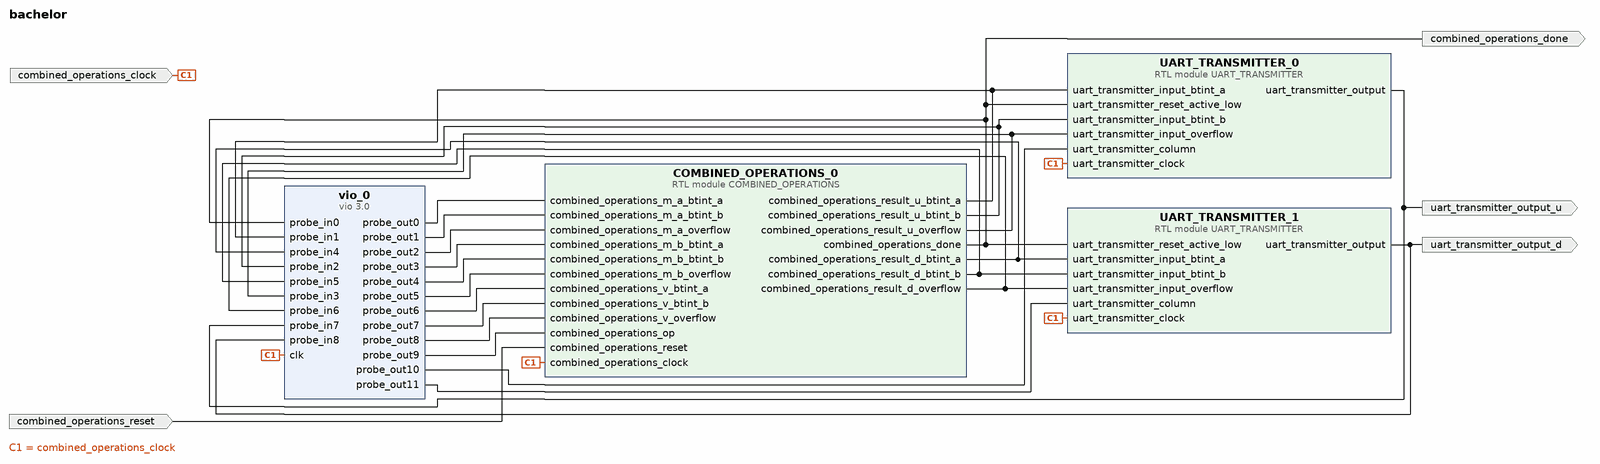
[diagram p0: block diagram of the top level]
# Vivado block design bachelor, xc7z020clg484-1, Vivado 2023.2
create_bd_design bachelor

create_bd_port -dir I -type clk combined_operations_clock
set_property -dict {CONFIG.ASSOCIATED_RESET combined_operations_reset} [get_bd_ports combined_operations_clock]
create_bd_port -dir I -type rst combined_operations_reset
create_bd_port -dir O combined_operations_done
create_bd_port -dir O uart_transmitter_output_u
create_bd_port -dir O uart_transmitter_output_d

create_bd_cell -type module -reference COMBINED_OPERATIONS COMBINED_OPERATIONS_0
create_bd_cell -type module -reference UART_TRANSMITTER UART_TRANSMITTER_0
create_bd_cell -type module -reference UART_TRANSMITTER UART_TRANSMITTER_1
create_bd_cell -type ip -vlnv xilinx.com:ip:vio:3.0 vio_0
set_property -dict [list \
  CONFIG.C_NUM_PROBE_IN 9 \
  CONFIG.C_NUM_PROBE_OUT 12 \
  CONFIG.C_PROBE_OUT0_WIDTH 96 \
  CONFIG.C_PROBE_OUT10_WIDTH 32 \
  CONFIG.C_PROBE_OUT11_WIDTH 32 \
  CONFIG.C_PROBE_OUT1_WIDTH 96 \
  CONFIG.C_PROBE_OUT2_WIDTH 24 \
  CONFIG.C_PROBE_OUT3_WIDTH 96 \
  CONFIG.C_PROBE_OUT4_WIDTH 96 \
  CONFIG.C_PROBE_OUT5_WIDTH 24 \
  CONFIG.C_PROBE_OUT6_WIDTH 24 \
  CONFIG.C_PROBE_OUT7_WIDTH 24 \
  CONFIG.C_PROBE_OUT8_WIDTH 6 \
  CONFIG.C_PROBE_OUT9_WIDTH 2 \
] [get_bd_cells vio_0]

# ---- connections ----

connect_bd_net [get_bd_pins COMBINED_OPERATIONS_0/combined_operations_done] \
  [get_bd_ports combined_operations_done] [get_bd_pins vio_0/probe_in0] \
  [get_bd_pins UART_TRANSMITTER_0/uart_transmitter_reset_active_low] \
  [get_bd_pins UART_TRANSMITTER_1/uart_transmitter_reset_active_low]
connect_bd_net [get_bd_pins COMBINED_OPERATIONS_0/combined_operations_result_d_btint_a] \
  [get_bd_pins vio_0/probe_in4] [get_bd_pins UART_TRANSMITTER_1/uart_transmitter_input_btint_a]
connect_bd_net [get_bd_pins COMBINED_OPERATIONS_0/combined_operations_result_d_btint_b] \
  [get_bd_pins vio_0/probe_in5] [get_bd_pins UART_TRANSMITTER_1/uart_transmitter_input_btint_b]
connect_bd_net [get_bd_pins COMBINED_OPERATIONS_0/combined_operations_result_d_overflow] \
  [get_bd_pins vio_0/probe_in6] [get_bd_pins UART_TRANSMITTER_1/uart_transmitter_input_overflow]
connect_bd_net [get_bd_pins COMBINED_OPERATIONS_0/combined_operations_result_u_btint_a] \
  [get_bd_pins vio_0/probe_in1] [get_bd_pins UART_TRANSMITTER_0/uart_transmitter_input_btint_a]
connect_bd_net [get_bd_pins COMBINED_OPERATIONS_0/combined_operations_result_u_btint_b] \
  [get_bd_pins vio_0/probe_in2] [get_bd_pins UART_TRANSMITTER_0/uart_transmitter_input_btint_b]
connect_bd_net [get_bd_pins COMBINED_OPERATIONS_0/combined_operations_result_u_overflow] \
  [get_bd_pins vio_0/probe_in3] [get_bd_pins UART_TRANSMITTER_0/uart_transmitter_input_overflow]
connect_bd_net [get_bd_pins UART_TRANSMITTER_0/uart_transmitter_output] [get_bd_ports uart_transmitter_output_u] [get_bd_pins vio_0/probe_in7]
connect_bd_net [get_bd_pins UART_TRANSMITTER_1/uart_transmitter_output] [get_bd_ports uart_transmitter_output_d] [get_bd_pins vio_0/probe_in8]
connect_bd_net -net combined_operations_clock_0_1 [get_bd_ports combined_operations_clock] \
  [get_bd_pins vio_0/clk] [get_bd_pins COMBINED_OPERATIONS_0/combined_operations_clock] \
  [get_bd_pins UART_TRANSMITTER_0/uart_transmitter_clock] [get_bd_pins UART_TRANSMITTER_1/uart_transmitter_clock]
connect_bd_net -net combined_operations_reset_0_1 [get_bd_ports combined_operations_reset] \
  [get_bd_pins COMBINED_OPERATIONS_0/combined_operations_reset]
connect_bd_net [get_bd_pins vio_0/probe_out0] [get_bd_pins COMBINED_OPERATIONS_0/combined_operations_m_a_btint_a]
connect_bd_net [get_bd_pins vio_0/probe_out1] [get_bd_pins COMBINED_OPERATIONS_0/combined_operations_m_a_btint_b]
connect_bd_net [get_bd_pins vio_0/probe_out2] [get_bd_pins COMBINED_OPERATIONS_0/combined_operations_m_a_overflow]
connect_bd_net [get_bd_pins vio_0/probe_out3] [get_bd_pins COMBINED_OPERATIONS_0/combined_operations_m_b_btint_a]
connect_bd_net [get_bd_pins vio_0/probe_out4] [get_bd_pins COMBINED_OPERATIONS_0/combined_operations_m_b_btint_b]
connect_bd_net [get_bd_pins vio_0/probe_out5] [get_bd_pins COMBINED_OPERATIONS_0/combined_operations_m_b_overflow]
connect_bd_net [get_bd_pins vio_0/probe_out6] [get_bd_pins COMBINED_OPERATIONS_0/combined_operations_v_btint_a]
connect_bd_net [get_bd_pins vio_0/probe_out7] [get_bd_pins COMBINED_OPERATIONS_0/combined_operations_v_btint_b]
connect_bd_net [get_bd_pins vio_0/probe_out8] [get_bd_pins COMBINED_OPERATIONS_0/combined_operations_v_overflow]
connect_bd_net [get_bd_pins vio_0/probe_out9] [get_bd_pins COMBINED_OPERATIONS_0/combined_operations_op]
connect_bd_net [get_bd_pins vio_0/probe_out10] [get_bd_pins UART_TRANSMITTER_0/uart_transmitter_column]
connect_bd_net [get_bd_pins vio_0/probe_out11] [get_bd_pins UART_TRANSMITTER_1/uart_transmitter_column]

validate_bd_design
save_bd_design
